# Altium schematic sheet Handshake.SchDoc: Megabit Final Handshake Circuitry
size A4; DocumentNumber: 5; Revision: 1; SheetNumber: 5; SheetTotal: 5
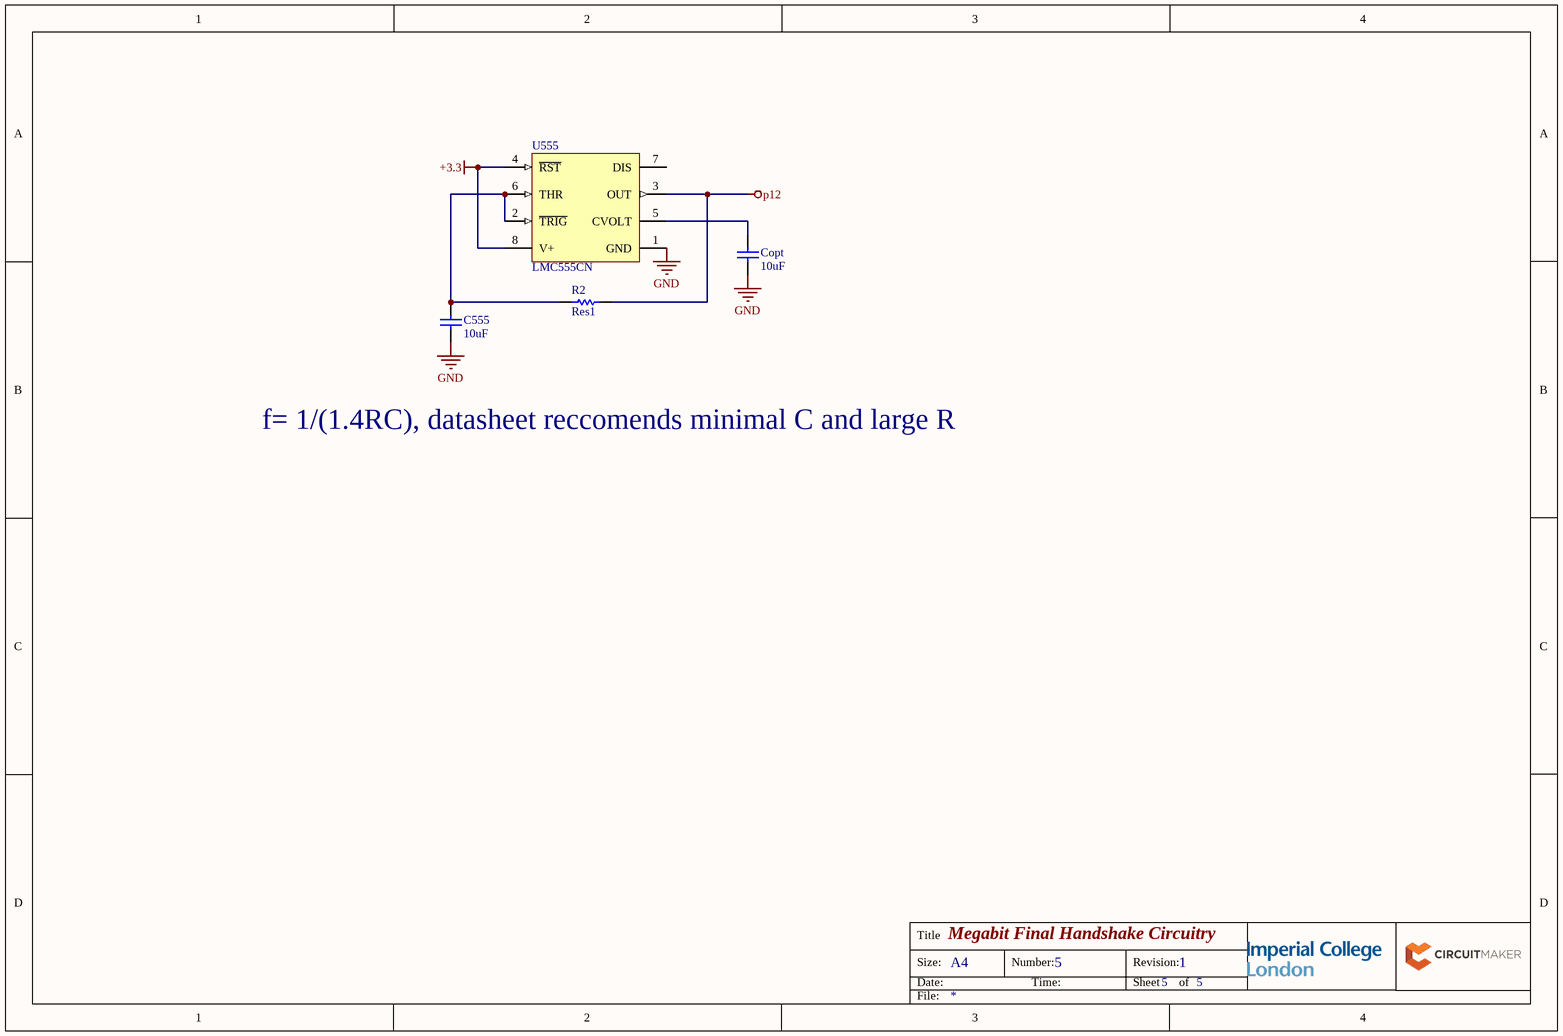
[diagram p0: Handshake.SchDoc]

## Parts
C555  10uF  [Vishay K104K15X7RF5TL2]
Copt  10uF  [Vishay K104K15X7RF5TL2]
R2  Res1  [PCB-3613466-1]
U555  LMC555CN  [N08E]

## Nets
+3.3: U555.4(~{RST}) U555.8(V+)
GND: C555.1 Copt.1 U555.1(GND)
p12: R2.1 U555.3(OUT)
NetC555_2: C555.2 R2.2 U555.2(~{TRIG}) U555.6(THR)
NetCopt_2: Copt.2 U555.5(CVOLT)

Not connected (* = marked no-connect by the designer): U555 7(DIS)

## Notes on the sheet
- f= 1/(1.4RC), datasheet reccomends minimal C and large R
- Title
- Size:
- Date:
- A4
- Number:
- Time:
- Revision:
- Sheet
- of
- File:

## Library data of the parts
C555 Copt = CMP-124240-16: K Series 100nF 50 V ±10 % Tolerance X7R Radial Multilayer Ceramic Capacitor; Manufacturer Part Number: K104K15X7RF5TL2; Lead Length: 30mm; Lead-Free Status: Lead Free; Voltage Rating (DC): 50 V; Capacitance Tolerance: ±10%; Size-Height: 5.6mm; Size-Width: 4.0mm; Mounting Style: Through Hole; OctopartID: e7292e20c87538ee; Number of Pins: 2; Packaging: Cut Tape (CT), Tape & Reel (TR); Capacitance: 100 nF; Octopart URL: http://octopart.com/k104k15x7rf5tl2-vishay+bccomponents-199226; Dielectric Material: Ceramic; Dielectric Characteristic: X7R; Size-Lead Diameter: 0.5mm; RoHS: Compliant; Size-Thickness: 2.6mm
R2 = CMP-b15c796618a36e9b-3: Resistor 0.25W; OctopartID: b15c796618a36e9b
U555 = CMP-0056-00035-3: CMOS Timer, 8-pin MDIP; Frequency: 3000000.0 Hz; Lead-Free Status: Contains Lead; Quiescent Current: 5e-05 A; Lifecycle Status: Active; Number of Pins: 8; Octopart Url: https://octopart.com/lmc555cn-texas+instruments-9341523; OctopartID: d11b189f7e2e0edc; Packaging: Rail; REACH SVHC Compliance: No SVHC; RoHS: Non-Compliant